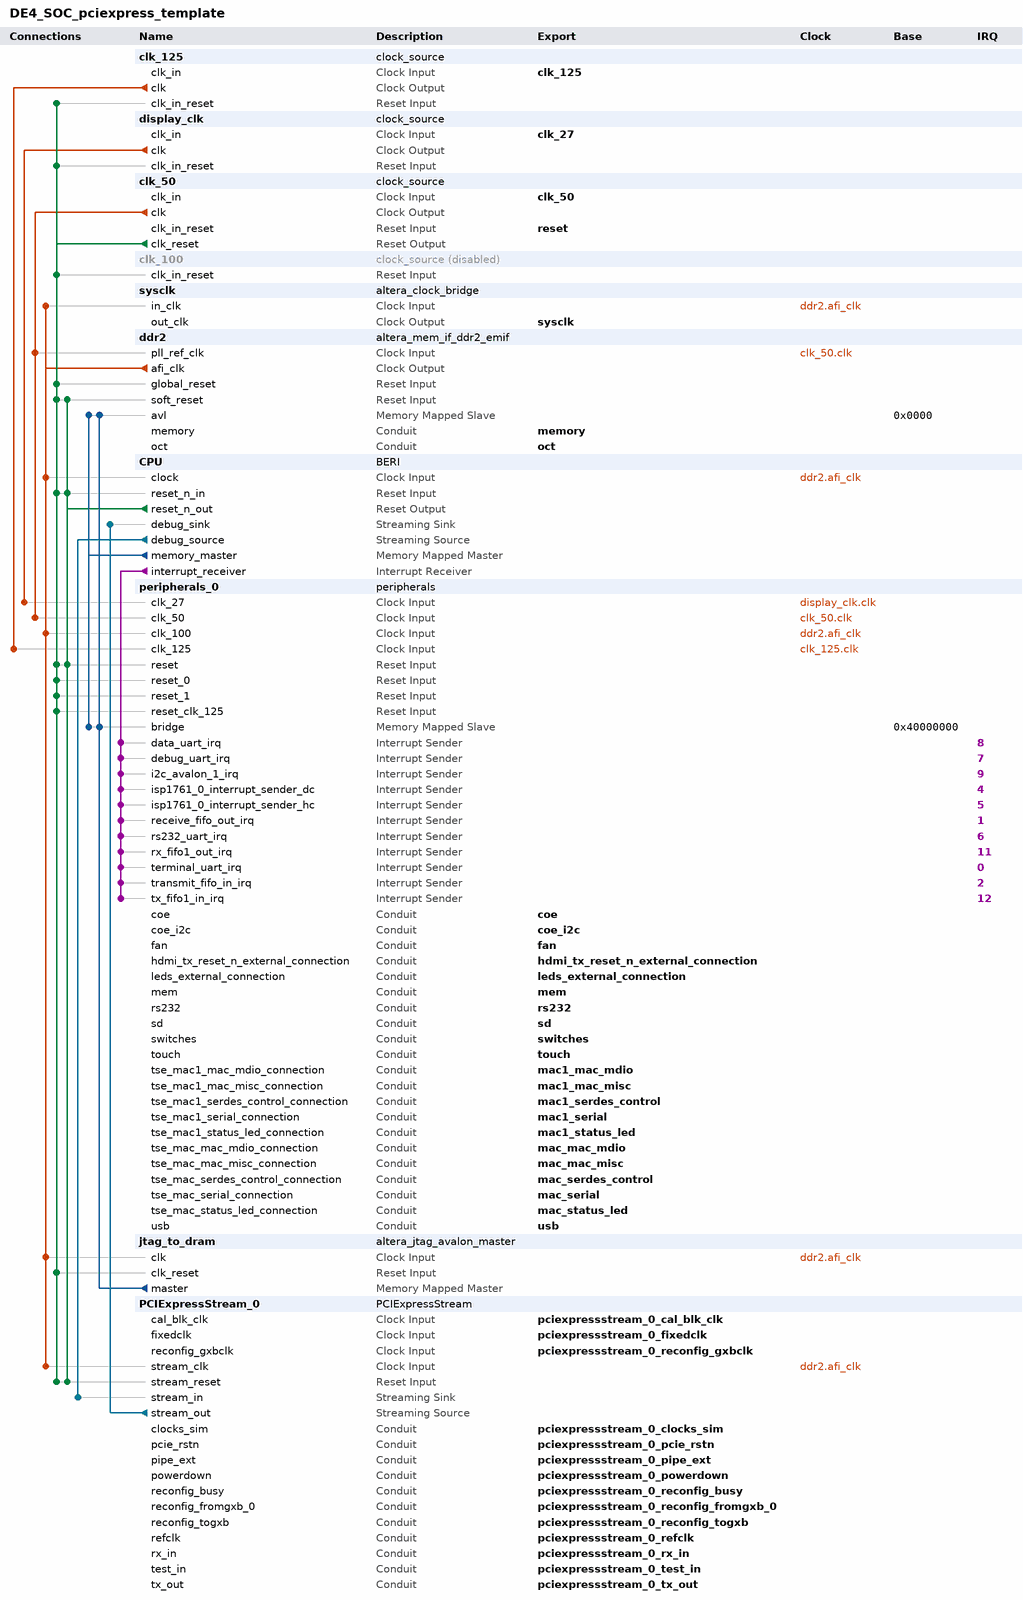
[diagram p0: system contents]
# Platform Designer (Qsys) system DE4_SOC_pciexpress_template, Stratix IV EP4SGX230KF40C2
# Parameters at their usual value, and those the tool derives, are not listed.
package require -exact qsys 13.1
create_system DE4_SOC_pciexpress_template
set_project_property DEVICE_FAMILY {Stratix IV}
set_project_property DEVICE EP4SGX230KF40C2

add_instance clk_125 clock_source 13.1
set_instance_parameter_value clk_125 clockFrequency 125000000

add_instance display_clk clock_source 13.1
set_instance_parameter_value display_clk clockFrequency 27000000

add_instance clk_50 clock_source 13.1
set_instance_parameter_value clk_50 clockFrequency 50000000

add_instance clk_100 clock_source 13.1
set_instance_property clk_100 ENABLED false
set_instance_parameter_value clk_100 clockFrequency 100000000

add_instance sysclk altera_clock_bridge 13.1
set_instance_parameter_value sysclk DERIVED_CLOCK_RATE 100000000
set_instance_parameter_value sysclk EXPLICIT_CLOCK_RATE 0

add_instance ddr2 altera_mem_if_ddr2_emif 13.1
set_instance_parameter_value ddr2 MEM_CLK_FREQ 200.0
set_instance_parameter_value ddr2 MEM_VENDOR JEDEC
set_instance_parameter_value ddr2 MEM_ROW_ADDR_WIDTH 14
set_instance_parameter_value ddr2 MEM_COL_ADDR_WIDTH 10
set_instance_parameter_value ddr2 MEM_DQ_WIDTH 64
set_instance_parameter_value ddr2 MEM_BANKADDR_WIDTH 3
set_instance_parameter_value ddr2 MEM_NUMBER_OF_RANKS_PER_DIMM 1
set_instance_parameter_value ddr2 MEM_VERBOSE false
set_instance_parameter_value ddr2 MEM_BL 4
set_instance_parameter_value ddr2 MEM_TCL 6
set_instance_parameter_value ddr2 TIMING_TIH 375
set_instance_parameter_value ddr2 TIMING_TDQSQ 200
set_instance_parameter_value ddr2 TIMING_TQHS 300
set_instance_parameter_value ddr2 MEM_TRAS_NS 40.0
set_instance_parameter_value ddr2 POWER_OF_TWO_BUS true
set_instance_parameter_value ddr2 AVL_MAX_SIZE 16
set_instance_parameter_value ddr2 CFG_REORDER_DATA false
set_instance_parameter_value ddr2 REF_CLK_FREQ 50.0
set_instance_parameter_value ddr2 DEFAULT_FAST_SIM_MODEL true
set_instance_parameter_value ddr2 PLL_SHARING_MODE None
set_instance_parameter_value ddr2 EXPORT_AFI_HALF_CLK false
set_instance_parameter_value ddr2 SKIP_MEM_INIT false
set_instance_parameter_value ddr2 CALIBRATION_MODE Skip
set_instance_parameter_value ddr2 USER_DEBUG_LEVEL 0
set_instance_parameter_value ddr2 TIMING_BOARD_AC_TO_CK_SKEW 0.0
set_instance_parameter_value ddr2 DLL_SHARING_MODE None

add_instance CPU BERI 1.0

add_instance peripherals_0 peripherals 1.0

add_instance jtag_to_dram altera_jtag_avalon_master 13.1

add_instance PCIExpressStream_0 PCIExpressStream 1.0

# connections
add_connection clk_50.clk ddr2.pll_ref_clk clock
add_connection clk_50.clk peripherals_0.clk_50 clock
add_connection clk_125.clk peripherals_0.clk_125 clock
add_connection ddr2.afi_clk CPU.clock clock
add_connection ddr2.afi_clk jtag_to_dram.clk clock
add_connection ddr2.afi_clk PCIExpressStream_0.stream_clk clock
add_connection ddr2.afi_clk peripherals_0.clk_100 clock
add_connection ddr2.afi_clk sysclk.in_clk clock
add_connection display_clk.clk peripherals_0.clk_27 clock
add_connection clk_50.clk_reset clk_100.clk_in_reset reset
add_connection clk_50.clk_reset clk_125.clk_in_reset reset
add_connection clk_50.clk_reset CPU.reset_n_in reset
add_connection clk_50.clk_reset ddr2.global_reset reset
add_connection clk_50.clk_reset ddr2.soft_reset reset
add_connection clk_50.clk_reset display_clk.clk_in_reset reset
add_connection clk_50.clk_reset jtag_to_dram.clk_reset reset
add_connection clk_50.clk_reset PCIExpressStream_0.stream_reset reset
add_connection clk_50.clk_reset peripherals_0.reset reset
add_connection clk_50.clk_reset peripherals_0.reset_0 reset
add_connection clk_50.clk_reset peripherals_0.reset_1 reset
add_connection clk_50.clk_reset peripherals_0.reset_clk_125 reset
add_connection CPU.reset_n_out CPU.reset_n_in reset
add_connection CPU.reset_n_out ddr2.soft_reset reset
add_connection CPU.reset_n_out PCIExpressStream_0.stream_reset reset
add_connection CPU.reset_n_out peripherals_0.reset reset
add_connection CPU.memory_master ddr2.avl avalon
set_connection_parameter_value CPU.memory_master/ddr2.avl baseAddress 0x0000
add_connection CPU.memory_master peripherals_0.bridge avalon
set_connection_parameter_value CPU.memory_master/peripherals_0.bridge baseAddress 0x40000000
add_connection jtag_to_dram.master ddr2.avl avalon
set_connection_parameter_value jtag_to_dram.master/ddr2.avl baseAddress 0x0000
add_connection jtag_to_dram.master peripherals_0.bridge avalon
set_connection_parameter_value jtag_to_dram.master/peripherals_0.bridge baseAddress 0x40000000
add_connection CPU.debug_source PCIExpressStream_0.stream_in avalon_streaming
add_connection PCIExpressStream_0.stream_out CPU.debug_sink avalon_streaming
add_connection CPU.interrupt_receiver peripherals_0.data_uart_irq interrupt
set_connection_parameter_value CPU.interrupt_receiver/peripherals_0.data_uart_irq irqNumber 8
add_connection CPU.interrupt_receiver peripherals_0.debug_uart_irq interrupt
set_connection_parameter_value CPU.interrupt_receiver/peripherals_0.debug_uart_irq irqNumber 7
add_connection CPU.interrupt_receiver peripherals_0.i2c_avalon_1_irq interrupt
set_connection_parameter_value CPU.interrupt_receiver/peripherals_0.i2c_avalon_1_irq irqNumber 9
add_connection CPU.interrupt_receiver peripherals_0.isp1761_0_interrupt_sender_dc interrupt
set_connection_parameter_value CPU.interrupt_receiver/peripherals_0.isp1761_0_interrupt_sender_dc irqNumber 4
add_connection CPU.interrupt_receiver peripherals_0.isp1761_0_interrupt_sender_hc interrupt
set_connection_parameter_value CPU.interrupt_receiver/peripherals_0.isp1761_0_interrupt_sender_hc irqNumber 5
add_connection CPU.interrupt_receiver peripherals_0.receive_fifo_out_irq interrupt
set_connection_parameter_value CPU.interrupt_receiver/peripherals_0.receive_fifo_out_irq irqNumber 1
add_connection CPU.interrupt_receiver peripherals_0.rs232_uart_irq interrupt
set_connection_parameter_value CPU.interrupt_receiver/peripherals_0.rs232_uart_irq irqNumber 6
add_connection CPU.interrupt_receiver peripherals_0.rx_fifo1_out_irq interrupt
set_connection_parameter_value CPU.interrupt_receiver/peripherals_0.rx_fifo1_out_irq irqNumber 11
add_connection CPU.interrupt_receiver peripherals_0.terminal_uart_irq interrupt
set_connection_parameter_value CPU.interrupt_receiver/peripherals_0.terminal_uart_irq irqNumber 0
add_connection CPU.interrupt_receiver peripherals_0.transmit_fifo_in_irq interrupt
set_connection_parameter_value CPU.interrupt_receiver/peripherals_0.transmit_fifo_in_irq irqNumber 2
add_connection CPU.interrupt_receiver peripherals_0.tx_fifo1_in_irq interrupt
set_connection_parameter_value CPU.interrupt_receiver/peripherals_0.tx_fifo1_in_irq irqNumber 12

# exported interfaces
add_interface memory conduit end
set_interface_property memory EXPORT_OF ddr2.memory
add_interface oct conduit end
set_interface_property oct EXPORT_OF ddr2.oct
add_interface clk_50 clock sink
set_interface_property clk_50 EXPORT_OF clk_50.clk_in
add_interface reset reset sink
set_interface_property reset EXPORT_OF clk_50.clk_in_reset
add_interface clk_27 clock sink
set_interface_property clk_27 EXPORT_OF display_clk.clk_in
add_interface clk_125 clock sink
set_interface_property clk_125 EXPORT_OF clk_125.clk_in
add_interface coe conduit end
set_interface_property coe EXPORT_OF peripherals_0.coe
add_interface touch conduit end
set_interface_property touch EXPORT_OF peripherals_0.touch
add_interface mem conduit end
set_interface_property mem EXPORT_OF peripherals_0.mem
add_interface leds_external_connection conduit end
set_interface_property leds_external_connection EXPORT_OF peripherals_0.leds_external_connection
add_interface hdmi_tx_reset_n_external_connection conduit end
set_interface_property hdmi_tx_reset_n_external_connection EXPORT_OF peripherals_0.hdmi_tx_reset_n_external_connection
add_interface switches conduit end
set_interface_property switches EXPORT_OF peripherals_0.switches
add_interface coe_i2c conduit end
set_interface_property coe_i2c EXPORT_OF peripherals_0.coe_i2c
add_interface sd conduit end
set_interface_property sd EXPORT_OF peripherals_0.sd
add_interface usb conduit end
set_interface_property usb EXPORT_OF peripherals_0.usb
add_interface fan conduit end
set_interface_property fan EXPORT_OF peripherals_0.fan
add_interface rs232 conduit end
set_interface_property rs232 EXPORT_OF peripherals_0.rs232
add_interface mac_mac_mdio conduit end
set_interface_property mac_mac_mdio EXPORT_OF peripherals_0.tse_mac_mac_mdio_connection
add_interface mac_mac_misc conduit end
set_interface_property mac_mac_misc EXPORT_OF peripherals_0.tse_mac_mac_misc_connection
add_interface mac_status_led conduit end
set_interface_property mac_status_led EXPORT_OF peripherals_0.tse_mac_status_led_connection
add_interface mac_serdes_control conduit end
set_interface_property mac_serdes_control EXPORT_OF peripherals_0.tse_mac_serdes_control_connection
add_interface mac_serial conduit end
set_interface_property mac_serial EXPORT_OF peripherals_0.tse_mac_serial_connection
add_interface mac1_mac_mdio conduit end
set_interface_property mac1_mac_mdio EXPORT_OF peripherals_0.tse_mac1_mac_mdio_connection
add_interface mac1_mac_misc conduit end
set_interface_property mac1_mac_misc EXPORT_OF peripherals_0.tse_mac1_mac_misc_connection
add_interface mac1_status_led conduit end
set_interface_property mac1_status_led EXPORT_OF peripherals_0.tse_mac1_status_led_connection
add_interface mac1_serdes_control conduit end
set_interface_property mac1_serdes_control EXPORT_OF peripherals_0.tse_mac1_serdes_control_connection
add_interface mac1_serial conduit end
set_interface_property mac1_serial EXPORT_OF peripherals_0.tse_mac1_serial_connection
add_interface sysclk clock source
set_interface_property sysclk EXPORT_OF sysclk.out_clk
add_interface pciexpressstream_0_refclk conduit end
set_interface_property pciexpressstream_0_refclk EXPORT_OF PCIExpressStream_0.refclk
add_interface pciexpressstream_0_test_in conduit end
set_interface_property pciexpressstream_0_test_in EXPORT_OF PCIExpressStream_0.test_in
add_interface pciexpressstream_0_pcie_rstn conduit end
set_interface_property pciexpressstream_0_pcie_rstn EXPORT_OF PCIExpressStream_0.pcie_rstn
add_interface pciexpressstream_0_clocks_sim conduit end
set_interface_property pciexpressstream_0_clocks_sim EXPORT_OF PCIExpressStream_0.clocks_sim
add_interface pciexpressstream_0_reconfig_busy conduit end
set_interface_property pciexpressstream_0_reconfig_busy EXPORT_OF PCIExpressStream_0.reconfig_busy
add_interface pciexpressstream_0_pipe_ext conduit end
set_interface_property pciexpressstream_0_pipe_ext EXPORT_OF PCIExpressStream_0.pipe_ext
add_interface pciexpressstream_0_powerdown conduit end
set_interface_property pciexpressstream_0_powerdown EXPORT_OF PCIExpressStream_0.powerdown
add_interface pciexpressstream_0_tx_out conduit end
set_interface_property pciexpressstream_0_tx_out EXPORT_OF PCIExpressStream_0.tx_out
add_interface pciexpressstream_0_rx_in conduit end
set_interface_property pciexpressstream_0_rx_in EXPORT_OF PCIExpressStream_0.rx_in
add_interface pciexpressstream_0_fixedclk clock sink
set_interface_property pciexpressstream_0_fixedclk EXPORT_OF PCIExpressStream_0.fixedclk
add_interface pciexpressstream_0_reconfig_gxbclk clock sink
set_interface_property pciexpressstream_0_reconfig_gxbclk EXPORT_OF PCIExpressStream_0.reconfig_gxbclk
add_interface pciexpressstream_0_reconfig_togxb conduit end
set_interface_property pciexpressstream_0_reconfig_togxb EXPORT_OF PCIExpressStream_0.reconfig_togxb
add_interface pciexpressstream_0_reconfig_fromgxb_0 conduit end
set_interface_property pciexpressstream_0_reconfig_fromgxb_0 EXPORT_OF PCIExpressStream_0.reconfig_fromgxb_0
add_interface pciexpressstream_0_cal_blk_clk clock sink
set_interface_property pciexpressstream_0_cal_blk_clk EXPORT_OF PCIExpressStream_0.cal_blk_clk

set_interconnect_requirement {$system} qsys_mm.clockCrossingAdapter AUTO
set_interconnect_requirement {$system} qsys_mm.maxAdditionalLatency 2

save_system DE4_SOC_pciexpress_template.qsys
